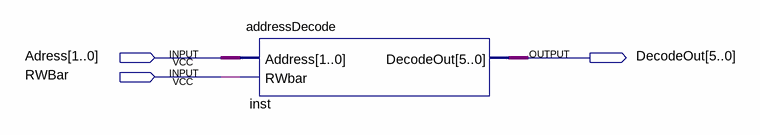
[diagram p0: schematic sheet]
// Quartus schematic testDecode.bdf as structural Verilog: 1 symbols, 3 pins
module testDecode (
  input  [1:0] Adress,
  input  RWBar,
  output [5:0] DecodeOut
);

  addressDecode inst (.Address(Adress), .RWbar(RWBar), .DecodeOut(DecodeOut));
endmodule
